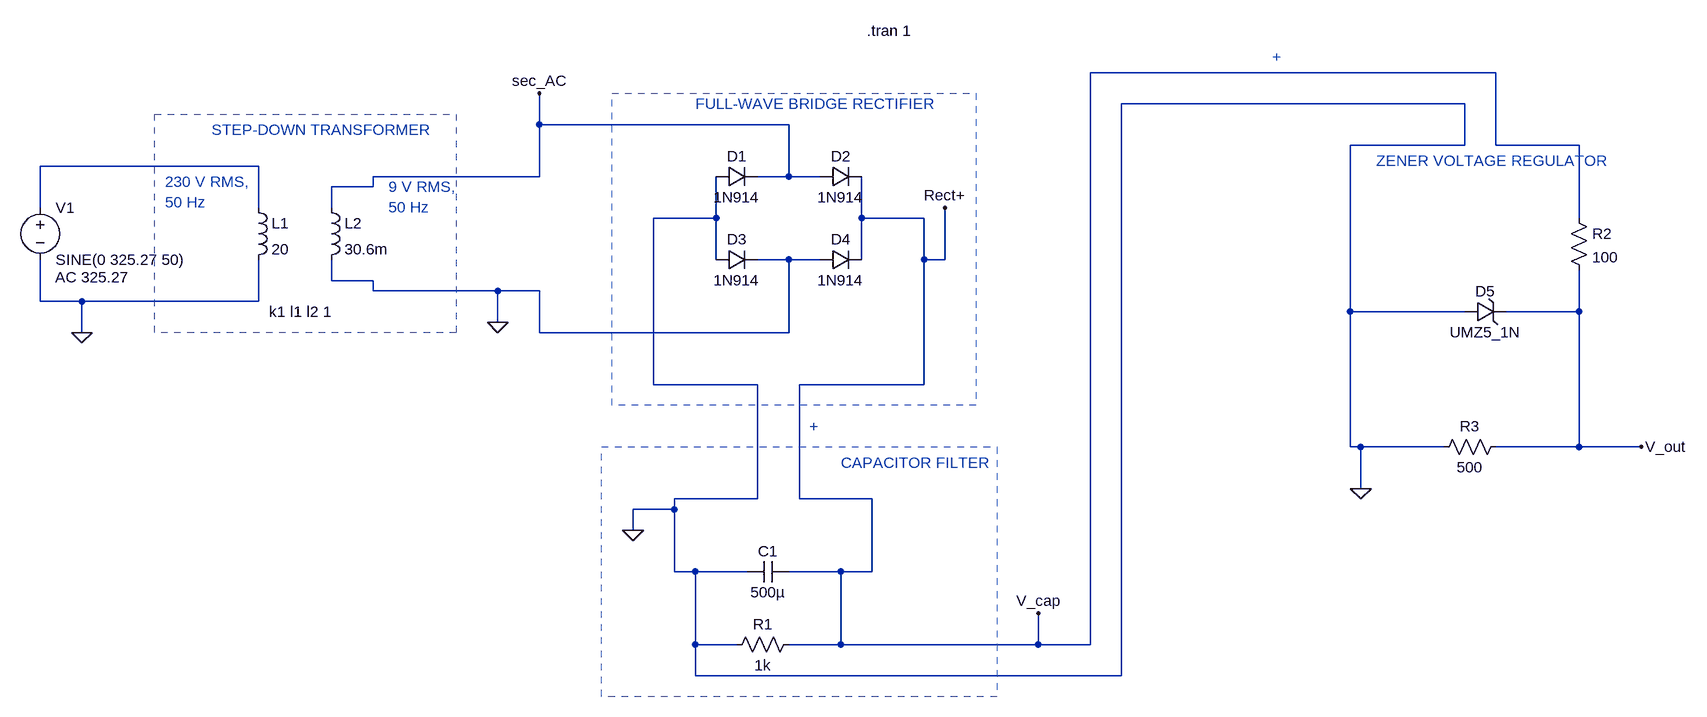
[diagram p0: schematic ac to 5 v regulated dc source.asc]
ac to 5 v regulated dc source.asc, the LTspice schematic file:
Version 4.1
SHEET 1 2160 872
WIRE 1792 -208 1168 -208
WIRE 1744 -160 1216 -160
WIRE 320 -128 320 -176
WIRE 704 -128 320 -128
WIRE 1744 -96 1744 -160
WIRE 1744 -96 1568 -96
WIRE 1792 -96 1792 -208
WIRE 1920 -96 1792 -96
WIRE -112 -64 -448 -64
WIRE 320 -48 320 -128
WIRE 320 -48 64 -48
WIRE 704 -48 704 -128
WIRE 704 -48 656 -48
WIRE 752 -48 704 -48
WIRE 64 -32 64 -48
WIRE 64 -32 0 -32
WIRE -448 0 -448 -64
WIRE -112 0 -112 -64
WIRE 0 0 0 -32
WIRE 592 16 592 -48
WIRE 592 16 496 16
WIRE 816 16 816 -48
WIRE 912 16 816 16
WIRE 1920 16 1920 -96
WIRE 592 80 592 16
WIRE 704 80 656 80
WIRE 752 80 704 80
WIRE 816 80 816 16
WIRE 912 80 912 16
WIRE 944 80 944 0
WIRE 944 80 912 80
WIRE 0 112 0 80
WIRE 64 112 0 112
WIRE 64 128 64 112
WIRE 256 128 64 128
WIRE 320 128 256 128
WIRE -448 144 -448 80
WIRE -384 144 -448 144
WIRE -112 144 -112 80
WIRE -112 144 -384 144
WIRE 1568 160 1568 -96
WIRE 1744 160 1568 160
WIRE 1920 160 1920 96
WIRE 1920 160 1808 160
WIRE 256 176 256 128
WIRE -384 192 -384 144
WIRE 320 192 320 128
WIRE 704 192 704 80
WIRE 704 192 320 192
WIRE 496 272 496 16
WIRE 656 272 496 272
WIRE 912 272 912 80
WIRE 912 272 720 272
WIRE 1568 368 1568 160
WIRE 1584 368 1568 368
WIRE 1712 368 1584 368
WIRE 1920 368 1920 160
WIRE 1920 368 1792 368
WIRE 2016 368 1920 368
WIRE 1584 432 1584 368
WIRE 656 448 656 272
WIRE 656 448 528 448
WIRE 720 448 720 272
WIRE 832 448 720 448
WIRE 528 464 528 448
WIRE 528 464 464 464
WIRE 464 496 464 464
WIRE 528 560 528 464
WIRE 560 560 528 560
WIRE 640 560 560 560
WIRE 784 560 704 560
WIRE 832 560 832 448
WIRE 832 560 784 560
WIRE 560 672 560 560
WIRE 624 672 560 672
WIRE 784 672 784 560
WIRE 784 672 704 672
WIRE 1088 672 1088 624
WIRE 1088 672 784 672
WIRE 1168 672 1168 -208
WIRE 1168 672 1088 672
WIRE 560 720 560 672
WIRE 1216 720 1216 -160
WIRE 1216 720 560 720
FLAG -384 192 0
FLAG 256 176 0
FLAG 464 496 0
FLAG 1584 432 0
FLAG 320 -176 sec_AC
FLAG 944 0 Rect+
FLAG 1088 624 V_cap
FLAG 2016 368 V_out
SYMBOL ind -128 -16 R0
SYMATTR InstName L1
SYMATTR Value 20
SYMATTR Type ind
SYMATTR SpiceLine Ipk=70 Rser=1 Rpar=390 Cpar=5.277p
SYMBOL ind -16 -16 R0
SYMATTR InstName L2
SYMATTR Value 30.6m
SYMATTR Type ind
SYMATTR SpiceLine Rser=1m
SYMBOL voltage -448 -16 R0
WINDOW 123 23 123 Left 2
WINDOW 39 0 0 Left 0
SYMATTR Value2 AC 325.27
SYMATTR InstName V1
SYMATTR Value SINE(0 325.27 50)
SYMBOL diode 592 -32 R270
WINDOW 0 32 32 VTop 2
WINDOW 3 0 32 VBottom 2
SYMATTR InstName D1
SYMATTR Value 1N914
SYMBOL diode 752 -32 R270
WINDOW 0 32 32 VTop 2
WINDOW 3 0 32 VBottom 2
SYMATTR InstName D2
SYMATTR Value 1N914
SYMBOL diode 592 96 R270
WINDOW 0 32 32 VTop 2
WINDOW 3 0 32 VBottom 2
SYMATTR InstName D3
SYMATTR Value 1N914
SYMBOL diode 752 96 R270
WINDOW 0 32 32 VTop 2
WINDOW 3 0 32 VBottom 2
SYMATTR InstName D4
SYMATTR Value 1N914
SYMBOL res 720 656 R90
WINDOW 0 0 56 VBottom 2
WINDOW 3 32 56 VTop 2
SYMATTR InstName R1
SYMATTR Value 1k
SYMBOL cap 704 544 R90
WINDOW 0 0 32 VBottom 2
WINDOW 3 32 32 VTop 2
SYMATTR InstName C1
SYMATTR Value 500µ
SYMBOL res 1904 0 R0
SYMATTR InstName R2
SYMATTR Value 100
SYMBOL res 1808 352 R90
WINDOW 0 0 56 VBottom 2
WINDOW 3 32 56 VTop 2
SYMATTR InstName R3
SYMATTR Value 500
SYMBOL zener 1744 176 R270
WINDOW 0 32 32 VTop 2
WINDOW 3 0 32 VBottom 2
SYMATTR InstName D5
SYMATTR Value UMZ5_1N
SYMATTR Description Diode
SYMATTR Type diode
TEXT -184 -120 Left 2 ;STEP-DOWN TRANSFORMER
TEXT 88 -32 Left 2 ;9 V RMS, \n50 Hz
TEXT -256 -40 Left 2 ;230 V RMS,\n50 Hz
TEXT -96 160 Left 2 !k1 l1 l2 1
TEXT 560 -160 Left 2 ;FULL-WAVE BRIDGE RECTIFIER
TEXT 824 -272 Left 2 !.tran 1
TEXT 784 392 Left 2 ;CAPACITOR FILTER
TEXT 736 336 Left 2 ;+
TEXT 1448 -232 Left 2 ;+
TEXT 1608 -72 Left 2 ;ZENER VOLTAGE REGULATOR
RECTANGLE Normal 192 192 -272 -144 2
RECTANGLE Normal 992 304 432 -176 2
RECTANGLE Normal 1024 752 416 368 2

The netlist it stands for:
* ac to 5 v regulated dc source.asc
L1 N001 0 20 Ipk=70 Rser=1 Rpar=390 Cpar=5.277p
L2 sec_AC 0 30.6m Rser=1m
V1 N001 0 SINE(0 325.27 50) AC 325.27
D1 0 sec_AC 1N914
D2 sec_AC V_cap 1N914
D3 0 0 1N914
D4 0 V_cap 1N914
R1 V_cap 0 1k
C1 V_cap 0 500µ
R2 V_cap V_out 100
R3 V_out 0 500
D5 0 V_out UMZ5_1N
.model D D
.lib standard.dio
* STEP-DOWN TRANSFORMER
* 9 V RMS,
* 50 Hz
* 230 V RMS,
* 50 Hz
k1 l1 l2 1
* FULL-WAVE BRIDGE RECTIFIER
.tran 1
* CAPACITOR FILTER
* +
* +
* ZENER VOLTAGE REGULATOR
.backanno
.end